# EAGLE design untitled (EAGLE 8.4.3)
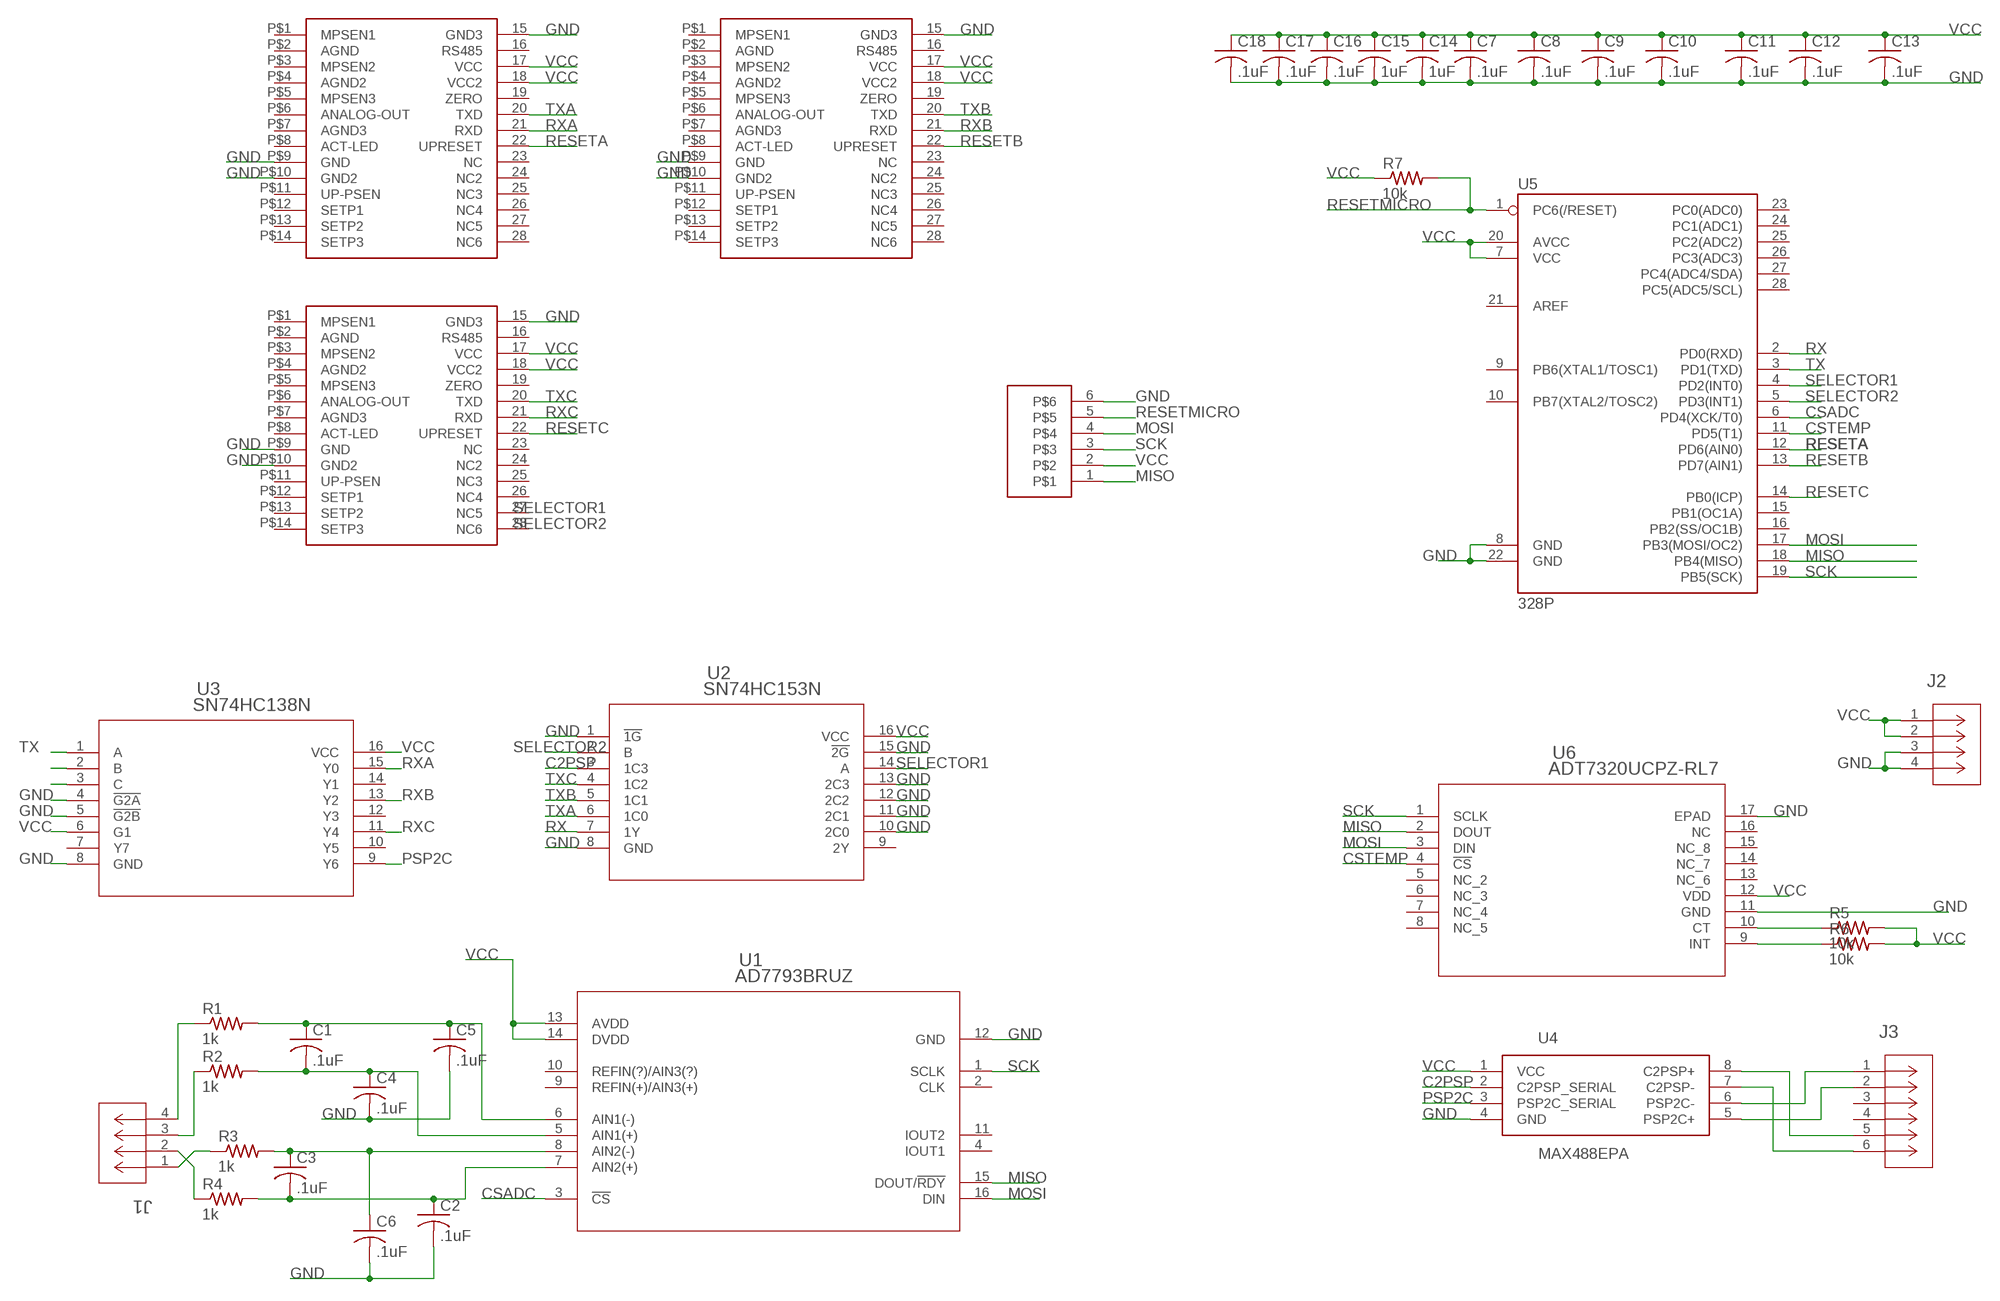
[diagram p0: schematic, sheet 1]

## Parts
C1  .1uF  C-USC0603  [C0603]
C2  .1uF  C-USC0603  [C0603]
C3  .1uF  C-USC0603  [C0603]
C4  .1uF  C-USC0603  [C0603]
C5  .1uF  C-USC0603  [C0603]
C6  .1uF  C-USC0603  [C0603]
C7  .1uF  C-USC0603  [C0603]
C8  .1uF  C-USC0603  [C0603]
C9  .1uF  C-USC0603  [C0603]
C10  .1uF  C-USC0603  [C0603]
C11  .1uF  C-USC0603  [C0603]
C12  .1uF  C-USC0603  [C0603]
C13  .1uF  C-USC0603  [C0603]
C14  1uF  C-USC1206  [C1206]
C15  1uF  C-USC1206  [C1206]
C16  .1uF  C-USC0603  [C0603]
C17  .1uF  C-USC0603  [C0603]
C18  .1uF  C-USC0603  [C0603]
J1  DF11-4  [DF11-4]
J2  DF11-4  [DF11-4]
J3  DF11-6DP-2DSA(01)  [CON6_2X3_UF_DF11]
R1  1k  R-US_R0603  [R0603]
R2  1k  R-US_R0603  [R0603]
R3  1k  R-US_R0603  [R0603]
R4  1k  R-US_R0603  [R0603]
R5  10k  R-US_R0603  [R0603]
R6  10k  R-US_R0603  [R0603]
R7  10k  R-US_R0603  [R0603]
U1  AD7793BRUZ  [RU_16]
U2  SN74HC153N  [N16]
U3  SN74HC138N  [N16]
U4  MAX488EPA  [DIL08]
U5  328P  ATMEGA328P_PDIP  [DIP28]
U6  ADT7320UCPZ-RL7  [CP_16_17]
U$1  PROGRAMMER  [PROGRAMMER]
U$2  MKS-PIRANI  [28PIN]
U$3  MKS-PIRANI  [28PIN]
U$4  MKS-PIRANI  [28PIN]

## Nets
C2PSP: U2.3(1C3) U4.2(C2PSP_SERIAL)
CSADC: U1.3(!CS) U5.6(PD4(XCK/T0))
CSTEMP: U5.11(PD5(T1)) U6.4(!CS)
GND: C2.2 C4.2 C5.2 C6.2 C7.2 C8.2 C9.2 C10.2 C11.2 C12.2 C13.2 C14.2 C15.2 C16.2 C17.2 C18.2 J2.3 J2.4 U1.12(GND) U2.1(!1G) U2.8(GND) U2.10(2C0) U2.11(2C1) U2.12(2C2) U2.13(2C3) U2.15(!2G) U3.4(!G2A) U3.5(!G2B) U3.8(GND) U4.4(GND) U5.8(GND) U5.22(GND) U6.11(GND) U6.17(EPAD) U$1.6 U$2.15(GND3) U$2.P$9(GND) U$2.P$10(GND2) U$3.15(GND3) U$3.P$9(GND) U$3.P$10(GND2) U$4.15(GND3) U$4.P$9(GND) U$4.P$10(GND2)
MISO: U1.15(DOUT/!RDY) U5.18(PB4(MISO)) U6.2(DOUT) U$1.1
MOSI: U1.16(DIN) U5.17(PB3(MOSI/OC2)) U6.3(DIN) U$1.4
N$1: J3.1 U4.6(PSP2C-)
N$2: J3.2 U4.5(PSP2C+)
N$3: J3.5 U4.8(C2PSP+)
N$4: J3.6 U4.7(C2PSP-)
N$5: C3.1 C6.1 R3.2 U1.8(AIN2(-))
N$6: J1.4 R1.1
N$7: J1.3 R2.1
N$8: J1.2 R4.1
N$9: J1.1 R3.1
N$10: C1.2 C4.1 R2.2 U1.5(AIN1(+))
N$13: C1.1 C5.1 R1.2 U1.6(AIN1(-))
N$14: C2.1 C3.2 R4.2 U1.7(AIN2(+))
N$28: R5.1 U6.10(CT)
N$29: R6.1 U6.9(INT)
PSP2C: U3.9(Y6) U4.3(PSP2C_SERIAL)
RESETA: U5.12(PD6(AIN0)) U$2.22(UPRESET)
RESETB: U5.13(PD7(AIN1)) U$4.22(UPRESET)
RESETC: U5.14(PB0(ICP)) U$3.22(UPRESET)
RESETMICRO: R7.2 U5.1(PC6(/RESET)) U$1.5
RX: U2.7(1Y) U5.2(PD0(RXD))
RXA: U3.15(Y0) U$2.21(RXD)
RXB: U3.13(Y2) U$4.21(RXD)
RXC: U3.11(Y4) U$3.21(RXD)
SCK: U1.1(SCLK) U5.19(PB5(SCK)) U6.1(SCLK) U$1.3
SELECTOR1: U2.14(A) U3.2(B) U5.4(PD2(INT0))
SELECTOR2: U2.2(B) U3.3(C) U5.5(PD3(INT1))
TX: U3.1(A) U5.3(PD1(TXD))
TXA: U2.6(1C0) U$2.20(TXD)
TXB: U2.5(1C1) U$4.20(TXD)
TXC: U2.4(1C2) U$3.20(TXD)
VCC: C7.1 C8.1 C9.1 C10.1 C11.1 C12.1 C13.1 C14.1 C15.1 C16.1 C17.1 C18.1 J2.1 J2.2 R5.2 R6.2 R7.1 U1.13(AVDD) U1.14(DVDD) U2.16(VCC) U3.6(G1) U3.16(VCC) U4.1(VCC) U5.7(VCC) U5.20(AVCC) U6.12(VDD) U$1.2 U$2.17(VCC) U$2.18(VCC2) U$3.17(VCC) U$3.18(VCC2) U$4.17(VCC) U$4.18(VCC2)
Unconnected: J3.3 J3.4 U1.2(CLK) U1.4(IOUT1) U1.9(REFIN(+)/AIN3(+)) U1.10(REFIN(?)/AIN3(?)) U1.11(IOUT2) U2.9(2Y) U3.7(Y7) U3.10(Y5) U3.12(Y3) U3.14(Y1) U5.9(PB6(XTAL1/TOSC1)) U5.10(PB7(XTAL2/TOSC2)) U5.15(PB1(OC1A)) U5.16(PB2(SS/OC1B)) U5.21(AREF) U5.23(PC0(ADC0)) U5.24(PC1(ADC1)) U5.25(PC2(ADC2)) U5.26(PC3(ADC3)) U5.27(PC4(ADC4/SDA)) U5.28(PC5(ADC5/SCL)) U6.5(NC_2) U6.6(NC_3) U6.7(NC_4) U6.8(NC_5) U6.13(NC_6) U6.14(NC_7) U6.15(NC_8) U6.16(NC) U$2.16(RS485) U$2.19(ZERO) U$2.23(NC) U$2.24(NC2) U$2.25(NC3) U$2.26(NC4) U$2.27(NC5) U$2.28(NC6) U$2.P$1(MPSEN1) U$2.P$2(AGND) U$2.P$3(MPSEN2) U$2.P$4(AGND2) U$2.P$5(MPSEN3) U$2.P$6(ANALOG-OUT) U$2.P$7(AGND3) U$2.P$8(ACT-LED) U$2.P$11(UP-PSEN) U$2.P$12(SETP1) U$2.P$13(SETP2) U$2.P$14(SETP3) U$3.16(RS485) U$3.19(ZERO) U$3.23(NC) U$3.24(NC2) U$3.25(NC3) U$3.26(NC4) U$3.27(NC5) U$3.28(NC6) U$3.P$1(MPSEN1) U$3.P$2(AGND) U$3.P$3(MPSEN2) U$3.P$4(AGND2) U$3.P$5(MPSEN3) U$3.P$6(ANALOG-OUT) U$3.P$7(AGND3) U$3.P$8(ACT-LED) U$3.P$11(UP-PSEN) U$3.P$12(SETP1) U$3.P$13(SETP2) U$3.P$14(SETP3) U$4.16(RS485) U$4.19(ZERO) U$4.23(NC) U$4.24(NC2) U$4.25(NC3) U$4.26(NC4) U$4.27(NC5) U$4.28(NC6) U$4.P$1(MPSEN1) U$4.P$2(AGND) U$4.P$3(MPSEN2) U$4.P$4(AGND2) U$4.P$5(MPSEN3) U$4.P$6(ANALOG-OUT) U$4.P$7(AGND3) U$4.P$8(ACT-LED) U$4.P$11(UP-PSEN) U$4.P$12(SETP1) U$4.P$13(SETP2) U$4.P$14(SETP3)

## Library data of the parts
C1-C18 = customrescap:C-US: CAPACITOR, American symbol
J1 J2 = libraryv4:DF11-4
J3 = libraryv4:DF11-6DP-2DSA(01)
R1-R7 = customrescap:R-US_: RESISTOR, American symbol
U1 = libraryv4:AD7793BRUZ; MANUFACTURER_PART_NUMBER: AD7793BRUZ; VENDOR: Analog Devices Inc
U2 = libraryv4:SN74HC153N; MANUFACTURER_PART_NUMBER: SN74HC153N; VENDOR: Texas Instruments
U3 = libraryv4:SN74HC138N; MANUFACTURER_PART_NUMBER: SN74HC138N; VENDOR: Texas Instruments
U4 = libraryv4:MAX488EPA
U5 = libraryv4:ATMEGA328P_PDIP: Atmel 328P Through hole ATMEGA328P uC used in the Arduino 32kb flash, 1k EEPROM, 2k SRAM Datasheet <http://www.sparkfun.com/datasheets/Components/SMD/ATMega328.pdf> SparkFun Products Storefront component: AVR 28 Pin 20MHz 32K 6A/D - ATMega328P <https://www.sparkfun.com/products/9061> (COM-09061) SparkFun Simon Says - Through-Hole Soldering Kit <https://www.sparkfun.com/products/10547> (KIT-10547) SparkFun Learn to Solder - Simon Says <https://www.sparkfun.com/products/13708> (KIT-13708) SparkFun BigTime Watch Kit <https://www.sparkfun.com/products/11734> (KIT-11734) SparkFun ClockIt <https://www.sparkfun.com/products/10930> (KIT-10930) SparkFun Serial Enabled LCD Kit <https://www.sparkfun.com/products/10097> (LCD-10097) SparkFun Simon Tilts - Through Hole Soldering Kit <https://www.sparkfun.com/products/12634> (KIT-12634) SparkFun Frequency Counter Kit <https://www.sparkfun.com/products/10140> (KIT-10140) FabFM Radio Kit <https://www.sparkfun.com/products/11043> (KIT-11043) SparkFun Binary Blaster Kit <https://www.sparkfun.com/products/12037> (KIT-12037) SparkFun Metro-Gnome <https://www.sparkfun.com/products/9236> (KIT-09236) ATmega328 with Arduino Optiboot (Uno) <https://www.sparkfun.com/products/10524> (DEV-10524); PROD_ID: IC-09136
U6 = libraryv4:ADT7320UCPZ-RL7; MANUFACTURER_PART_NUMBER: ADT7320UCPZRL7; VENDOR: Analog Devices Inc
U$1 = libraryv4:PROGRAMMER
U$2-U$4 = libraryv4:MKS-PIRANI

## Board
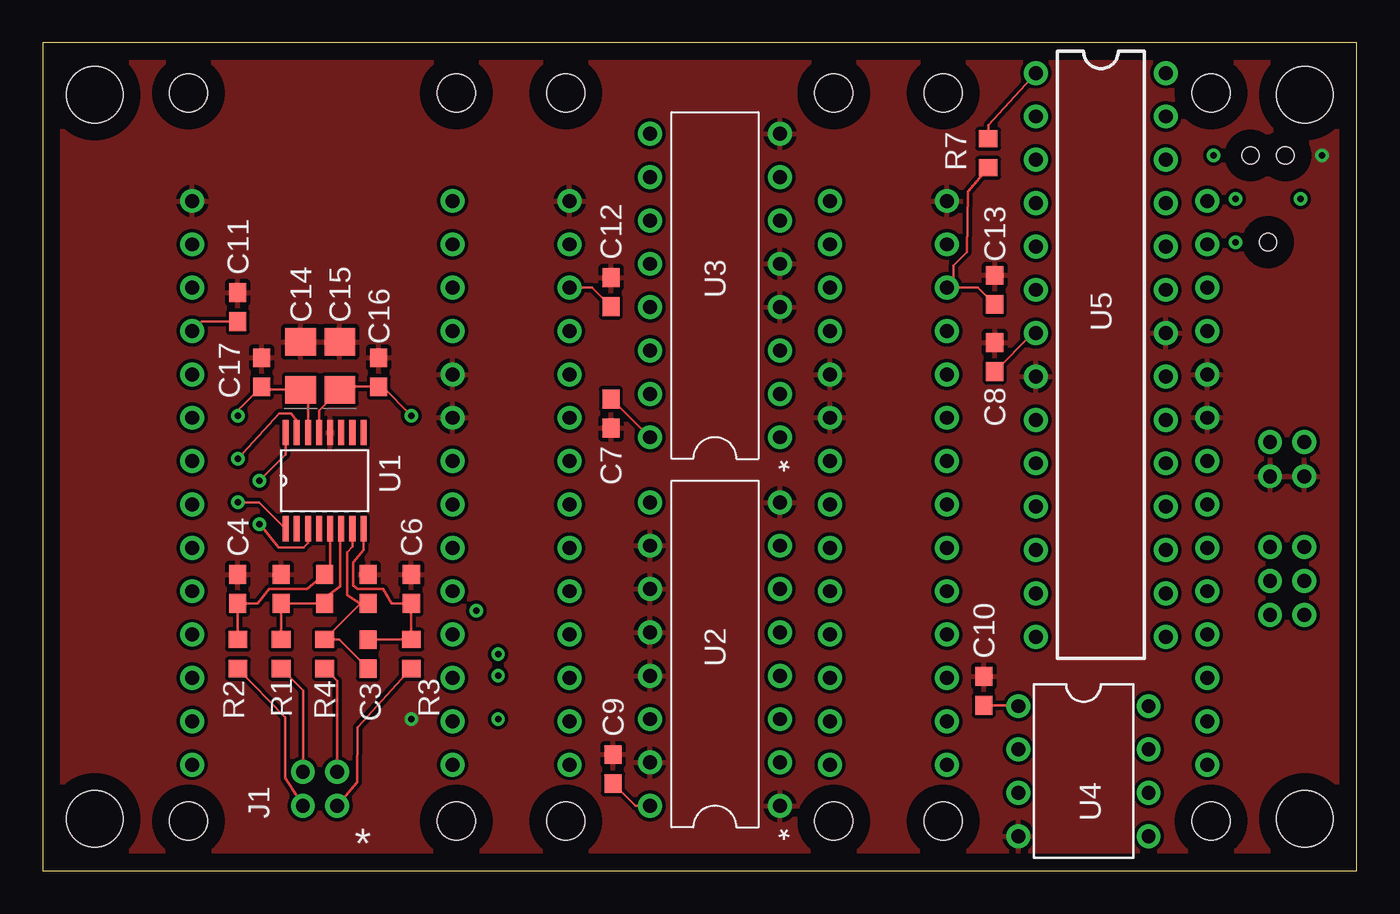
[diagram p1: board, top side]
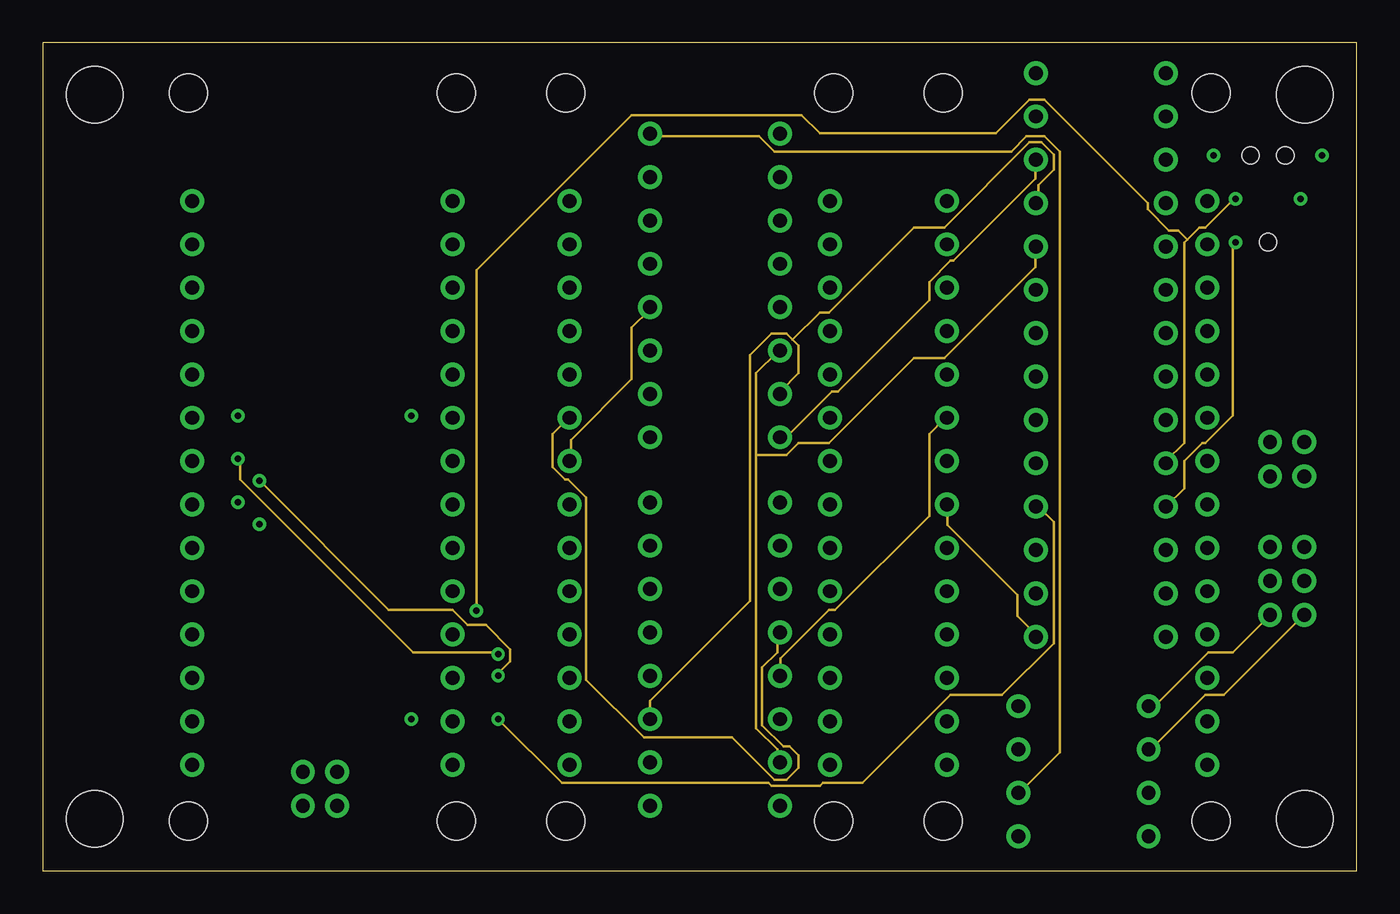
[diagram p2: board, inner layer Route2]
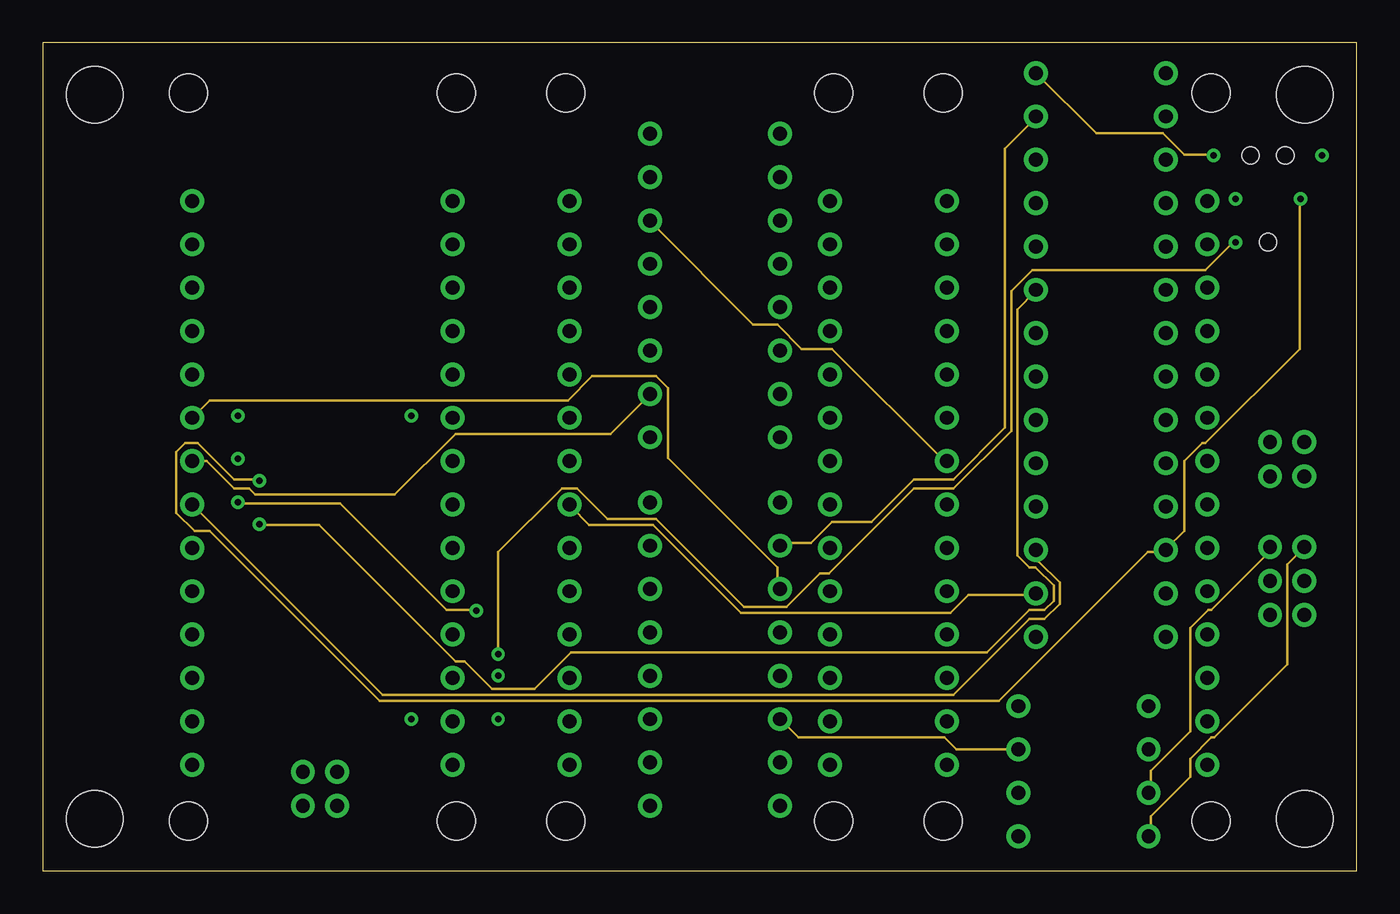
[diagram p3: board, inner layer Route3]
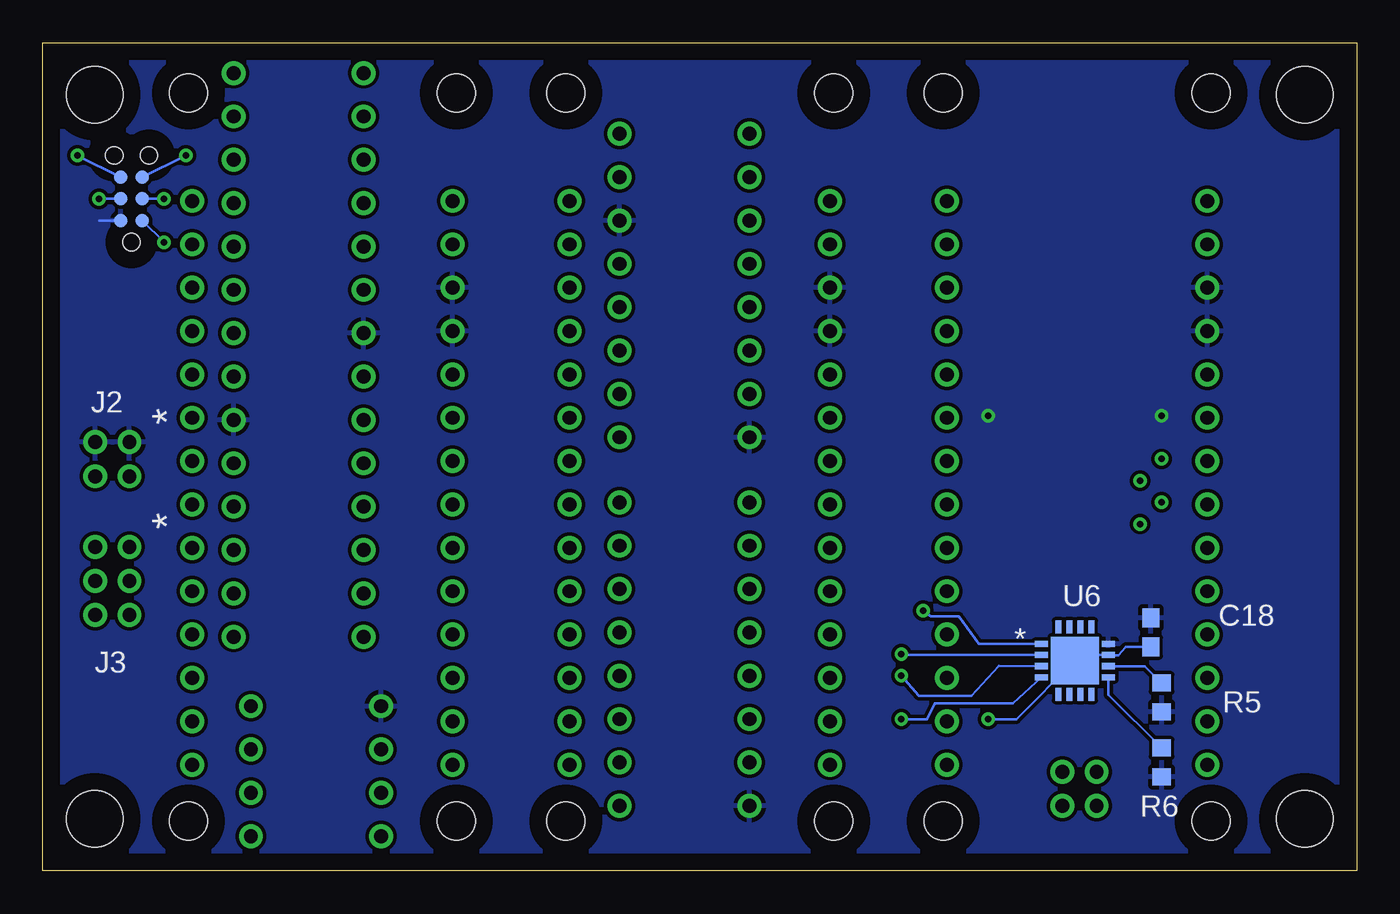
[diagram p4: board, bottom side, seen from below]

Size 76.96 x 48.51 mm. Coordinates in mm from the lower left corner, seen from the top.
Outline: 0,0 76.96,0 76.96,48.51 0,48.51 0,0
Copper layers (1*2*3*16): Top 0.035mm / dielectric 1.5mm / Route2 0.035mm / dielectric 0.15mm / Route3 0.035mm / dielectric 0.2mm / Bottom 0.035mm
Design rules "default *": minimum track width 6mil, minimum drill 15mil, track to track 8mil, track to pad 8mil, pad to pad 8mil, via to via 8mil, smd to smd 6mil, copper to edge 40mil, drill to drill 6mil, minimum pad ring 10mil, minimum via ring 8mil, stop-mask expansion 4mil, vias tented up to drill 0mil, thermal gap 10mil
Holes 3.3 mm at 3.05,3.05 3.05,45.47 73.91,45.47 73.91,3.05

### Footprints (pad centres in the part's own frame; a part is rotated, then mirrored left to right if it is on the bottom)
C0603 = smd 1.1 x 1: 1 -0.85,0; 2 0.85,0
C1206 = smd 1.6 x 1.8: 1 -1.4,0; 2 1.4,0
DF11-4 = drill 0.813 pad 1.397: 1 2,0; 2 2,2; 3 0,0; 4 0,2
CON6_2X3_UF_DF11 = drill 0.813 pad 1.397: 1 4,0; 2 4,2; 3 2,0; 4 2,2; 5 0,0; 6 0,2
R0603 = smd 1 x 1.1: 1 -0.85,0; 2 0.85,0
RU_16 = smd 1.473 x 0.356: 1 -2.819,2.275; 2 -2.819,1.625; 3 -2.819,0.975; 4 -2.819,0.325; 5 -2.819,-0.325; 6 -2.819,-0.975; 7 -2.819,-1.625; 8 -2.819,-2.275; 9 2.819,-2.275; 10 2.819,-1.625; 11 2.819,-0.975; 12 2.819,-0.325; 13 2.819,0.325; 14 2.819,0.975; 15 2.819,1.625; 16 2.819,2.275
N16 = drill 0.813 pad 1.397: 1 -7.62,17.78; 2 -7.62,15.24; 3 -7.62,12.7; 4 -7.62,10.16; 5 -7.62,7.62; 6 -7.62,5.08; 7 -7.62,2.54; 8 -7.62,0; 9 0,0; 10 0,2.54; 11 0,5.08; 12 0,7.62; 13 0,10.16; 14 0,12.7; 15 0,15.24; 16 0,17.78
DIL08 = drill 0.813 pad 1.397: 1 -3.81,-3.81; 2 -1.27,-3.81; 3 1.27,-3.81; 4 3.81,-3.81; 5 3.81,3.81; 6 1.27,3.81; 7 -1.27,3.81; 8 -3.81,3.81
DIP28 = drill 0.813 pad 1.397: 1 -16.51,-3.81; 2 -13.97,-3.81; 3 -11.43,-3.81; 4 -8.89,-3.81; 5 -6.35,-3.81; 6 -3.81,-3.81; 7 -1.27,-3.81; 8 1.27,-3.81; 9 3.81,-3.81; 10 6.35,-3.81; 11 8.89,-3.81; 12 11.43,-3.81; 13 13.97,-3.81; 14 16.51,-3.81; 15 16.51,3.81; 16 13.97,3.81; 17 11.43,3.81; 18 8.89,3.81; 19 6.35,3.81; 20 3.81,3.81; 21 1.27,3.81; 22 -1.27,3.81; 23 -3.81,3.81; 24 -6.35,3.81; 25 -8.89,3.81; 26 -11.43,3.81; 27 -13.97,3.81; 28 -16.51,3.81
CP_16_17 = smd 0.762 x 0.356: 1 -1.968,0.975; 2 -1.968,0.325; 3 -1.968,-0.325; 4 -1.968,-0.975; 9 1.968,-0.975; 10 1.968,-0.325; 11 1.968,0.325; 12 1.968,0.975 | smd 0.356 x 0.762: 5 -0.975,-1.968; 6 -0.325,-1.968; 7 0.325,-1.968; 8 0.975,-1.968; 13 0.975,1.968; 14 0.325,1.968; 15 -0.325,1.968; 16 -0.975,1.968 | smd 2.794 x 2.794: 17 0,0
PROGRAMMER = smd 0.787 x 0.787: 1 1.27,0; 2 1.27,1.27; 3 2.54,0; 4 2.54,1.27; 5 3.81,0; 6 3.81,1.27 | hole 0.991: 0,0.635; 5.08,-0.381; 5.08,1.651
28PIN = drill 0.813 pad 1.397: 15 2.794,38.862; 16 2.794,36.322; 17 2.794,33.782; 18 2.794,31.242; 19 2.794,28.702; 20 2.794,26.162; 21 2.794,23.622; 22 2.794,21.082; 23 2.794,18.542; 24 2.794,16.002; 25 2.794,13.462; 26 2.794,10.922; 27 2.794,8.382; 28 2.794,5.842; P$1 18.034,5.842; P$2 18.034,8.382; P$3 18.034,10.922; P$4 18.034,13.462; P$5 18.034,16.002; P$6 18.034,18.542; P$7 18.034,21.082; P$8 18.034,23.622; P$9 18.034,26.162; P$10 18.034,28.702; P$11 18.034,31.242; P$12 18.034,33.782; P$13 18.034,36.322; P$14 18.034,38.862 | hole 2.21: 18.263,45.187; 2.565,45.187; 18.263,2.54; 2.565,2.54

### Placement (x,y rotation side)
C1  16.51,16.51 90 top
C2  19.05,16.51 90 top
C3  19.05,12.7 270 top
C4  11.43,16.51 90 top
C5  13.97,16.51 90 top
C6  21.59,16.51 90 top
C7  33.27,26.8 270 top
C8  55.75,30.1 90 top
C9  33.4,5.97 90 top
C10  55.12,10.54 90 top
C11  11.43,33.02 90 top
C12  33.27,33.91 90 top
C13  55.75,34.04 90 top
C14  15.11,29.59 90 top
C15  17.4,29.59 90 top
C16  19.68,29.21 90 top
C17  12.83,29.21 90 top
C18  12.06,13.97 270 bottom
J1  15.24,3.81 0 top
J2  71.88,23.11 90 bottom
J3  71.88,14.99 90 bottom
R1  13.97,12.7 90 top
R2  11.43,12.7 90 top
R3  21.59,12.7 90 top
R4  16.51,12.7 90 top
R5  11.43,10.16 270 bottom
R6  11.43,6.35 270 bottom
R7  55.37,42.04 90 top
U1  16.51,22.86 90 top
U2  35.56,21.59 180 top
U3  35.56,43.18 180 top
U4  60.96,5.84 270 top
U5  61.98,30.23 270 top
U6  16.51,12.32 0 bottom
U$1  71.12,36.83 90 bottom
U$2  5.97,0.38 0 top
U$3  50.16,0.38 0 top
U$4  28.07,0.38 0 top

### Tracks (layer width: path | path; a pad name or v marks a point on that pad's centre or on a via)
C2PSP
  Route3 0.152: U4.2 53.52,7.11 52.81,7.82 44.27,7.82 43.2,8.89 U2.3
CSADC  (via drill 0.38)
  Top 0.152: U1.3 15.54,19.8 15.54,19.21 15.28,18.95 13.82,18.95 v12.7,20.32
  Route3 0.152: v12.7,20.32 12.8,20.27 16.18,20.27 24.18,12.27 24.71,12.27 26.31,10.67 28.8,10.67 30.94,12.8 55.3,12.8 57.78,15.29 58.67,15.29 59.21,15.82 59.21,16.71 58.14,17.78 57.78,17.78 57.07,18.49 57.07,32.89 58.14,33.96 U5.6
CSTEMP  (via drill 0.38)
  Route2 0.152: v26.67,8.89 30.4,5.16 42.49,5.16 42.67,4.98 45.52,4.98 45.7,5.16 48.01,5.16 53.16,10.31 56.19,10.31 59.21,13.34 59.21,20.45 58.32,21.34 U5.11
  Bottom 0.152: v26.67,8.89 25.19,8.89 24.72,9.82 20.13,9.82 U6.4
GND  (via drill 0.38)
  Bottom 0.152: C18.2 13.53,13.12 13.96,12.63 14.3,12.63 U6.11 16.18,12.64 U6.17 19.94,8.89 v21.59,8.89 | U$1.6 v74.93,41.91
  pour Top: 0,48.51 76.96,48.51 76.96,0 0,0
MISO  (via drill 0.38)
  Top 0.152: U1.15 14.88,26.39 14.55,26.8 13.84,26.8 v11.43,24.13
  Route2 0.152: U5.18 66.85,22.4 66.85,24 67.92,25.07 68.1,25.07 69.7,26.67 69.7,36.8 v69.85,36.83 | v11.43,24.13 11.56,24 11.56,22.94 21.69,12.8 26.67,12.8 v26.67,12.7
  Route3 0.152: v26.67,12.7 26.67,18.67 30.4,22.4 31.29,22.4 33.07,20.62 35.92,20.62 41.07,15.47 43.56,15.47 45.52,17.42 46.05,17.42 51.03,22.4 53.34,22.4 56.72,25.78 56.72,33.96 57.96,35.2 68.1,35.2 69.7,36.8 v69.85,36.83
  Bottom 0.152: U6.2 26.61,12.64 v26.67,12.7 | U$1.1 v69.85,36.83
MOSI  (via drill 0.38)
  Top 0.152: U1.16 14.23,24.39 v12.7,22.86
  Route2 0.152: v12.7,22.86 20.27,15.29 24,15.29 24.89,14.4 25.96,14.4 27.38,12.98 27.38,12.27 26.67,11.56 v26.67,11.43
  Route3 0.152: v73.66,39.37 73.61,39.29 73.61,30.58 68.1,25.07 67.92,25.07 66.85,24 66.85,19.91 65.79,18.85 U5.17 65.79,18.67 64.72,18.67 56.01,9.96 19.74,9.96 9.78,19.91 8.89,19.91 7.82,20.98 7.82,24.54 8.36,25.07 9.07,25.07 11.2,22.94 12.62,22.94 v12.7,22.86
  Bottom 0.152: U6.3 20.97,12.02 22.58,10.25 25.64,10.25 v26.67,11.43 | U$1.4 v73.66,39.37
N$1
  Route3 0.152: U4.6 64.9,4.62 64.9,5.87 67.21,8.18 67.21,14.22 68.28,15.29 68.45,15.29 72.01,18.85 J3.1
N$2
  Route3 0.152: U4.5 64.9,2.13 64.9,3.2 67.21,5.51 67.21,6.58 68.45,7.82 68.63,7.82 72.9,12.09 72.9,17.96 73.79,18.85 J3.2
N$3
  Route2 0.152: J3.5 69.7,12.8 68.28,12.8 65.25,9.78 64.9,9.78 U4.8
N$4
  Route2 0.152: U4.7 64.9,7.11 68.1,10.31 69.16,10.31 73.79,14.94 J3.6
N$5
  Top 0.152: C3.1 R3.2 C6.1 20.42,15.66 19.95,16.52 19.6,16.52 19.05,16.51 18.45,16.51 18.19,16.71 18.19,18.08 18.79,18.8 U1.8
N$6
  Top 0.152: J1.4 15.24,10.58 R1.1
N$7
  Top 0.152: J1.3 14.19,5.45 14.19,8.99 R2.1
N$8
  Top 0.152: R4.1 17.24,11.12 J1.2
N$9
  Top 0.152: J1.1 18.42,5.2 18.45,8.4 R3.1
N$10
  Top 0.152: R2.2 C4.1 12.6,15.66 13.27,16.52 15.49,16.52 C1.2 arc90 16.84,17.68 U1.5
N$13
  Top 0.152: R1.2 C5.1 C1.1 16.51,15.99 17.42,16.67 17.42,19.92 U1.6
N$14
  Top 0.152: C3.2 17.35,13.55 R4.2 18.62,15.66 C2.1 18.66,15.62 17.82,16.18 17.84,18.65 18.14,19.01 U1.7
N$28
  Bottom 0.152: R5.1 12.41,11.99 U6.10
N$29
  Bottom 0.152: R6.1 14.54,10.31 U6.9
PSP2C
  Route2 0.152: U3.9 35.56,43.03 41.96,43.03 42.85,42.14 56.72,42.14 57.61,43.03 58.67,43.03 59.56,42.14 59.56,6.93 57.25,4.62 U4.3
RESETA
  Route3 0.152: U$2.22 19.91,10.31 53.34,10.31 57.78,14.76 58.67,14.76 59.56,15.65 59.56,16.89 58.32,18.14 58.32,18.67 U5.12
RESETB
  Route3 0.152: U5.13 58.14,16.18 54.23,16.18 53.16,15.11 40.89,15.11 35.74,20.27 32,20.27 30.94,21.34 U$4.22
RESETC
  Route2 0.152: U$3.22 52.98,21.34 52.98,20.27 57.07,16.18 57.07,14.94 58.14,13.87 U5.14
RESETMICRO  (via drill 0.38)
  Top 0.152: R7.2 55.37,43.69 U5.1
  Route3 0.152: U5.1 61.7,43.2 65.61,43.2 66.85,41.96 68.45,41.96 v68.58,41.91
  Bottom 0.152: U$1.5 v68.58,41.91
RX
  Route3 0.152: U2.7 43.2,19.2 44.98,19.2 46.23,20.45 48.54,20.45 51.03,22.94 53.34,22.94 56.36,25.96 56.36,42.32 58.14,44.09 U5.2
RXA
  Route3 0.152: U$2.21 9.6,24 11.2,22.4 12.09,22.4 12.45,22.05 20.62,22.05 24.18,25.6 33.25,25.6 35.56,27.91 U3.15
RXB
  Route2 0.152: U$4.21 30.94,24 30.94,25.25 34.49,28.8 34.49,31.83 35.56,32.89 U3.13
RXC
  Route3 0.152: U$3.21 52.81,24 46.23,30.58 44.45,30.58 43.03,32 41.6,32 35.56,38.05 U3.11
SCK  (via drill 0.38)
  Top 0.152: U1.1 12.69,21.59 v11.43,21.59
  Route2 0.152: 67.03,36.98 66.85,36.8 66.85,25.07 65.79,24 U5.19 | 67.03,36.98 67.74,37.69 68.1,37.69 69.7,39.29 v69.85,39.37 | 67.03,36.98 66.5,37.52 65.96,37.52 64.72,38.76 64.72,39.12 58.67,45.16 57.78,45.16 55.83,43.2 45.52,43.2 44.45,44.27 34.49,44.27 25.43,35.2 25.43,15.29 v25.4,15.24
  Route3 0.152: v11.43,21.59 11.56,21.51 17.42,21.51 23.65,15.29 25.25,15.29 v25.4,15.24
  Bottom 0.152: U6.1 22.14,13.29 23.31,14.9 24.96,14.9 v25.4,15.24 | U$1.3 v69.85,39.37
SELECTOR1
  Route2 0.152: U2.14 35.56,9.96 41.43,15.82 41.43,30.23 42.67,31.47 43.56,31.47 43.92,31.11 | 43.92,31.11 44.27,30.76 44.27,29.16 43.2,28.09 U3.2 | 43.92,31.11 45.52,32.72 46.05,32.72 51.03,37.69 52.81,37.69 57.78,42.67 58.5,42.67 59.21,41.96 59.21,41.07 58.32,40.18 58.32,39.12 U5.4
SELECTOR2
  Route2 0.152: 41.78,24.36 41.78,29.16 43.03,30.4 U3.3 | 41.78,24.36 41.78,8.36 43.03,7.11 43.03,6.4 U2.2 | 41.78,24.36 43.56,24.36 44.27,25.07 46.05,25.07 51.03,30.05 52.81,30.05 58.14,35.38 58.14,36.45 U5.5
TX
  Route2 0.152: U3.1 43.2,25.43 43.56,25.43 46.23,28.09 46.58,28.09 51.92,33.43 51.92,34.49 53.16,35.74 53.34,35.74 58.14,40.54 58.14,41.6 U5.3
TXA
  Route3 0.152: U$2.20 9.78,27.56 30.76,27.56 32.18,28.98 35.92,28.98 36.63,28.27 36.63,24.18 43.03,17.78 43.03,16.54 U2.6
TXB
  Route2 0.152: U2.5 43.03,13.87 43.03,12.8 42.14,11.91 42.14,8.53 43.38,7.29 43.74,7.29 44.27,6.76 44.27,6.04 43.56,5.33 42.85,5.33 40.36,7.82 35.2,7.82 31.83,11.2 31.83,21.87 30.76,22.94 30.58,22.94 29.87,23.65 29.87,25.6 30.76,26.49 U$4.20
TXC
  Route2 0.152: U2.4 43.2,11.56 43.2,12.45 46.05,15.29 46.41,15.29 51.92,20.8 51.92,25.6 52.81,26.49 U$3.20
VCC  (via drill 0.38)
  Top 0.152: U1.14 15.54,27.77 arc90 C14.1 13,28.19 C17.1 11.43,26.96 v11.43,26.67 | U1.13 16.18,26.98 C15.1 17.57,28.36 C16.1 19.9,28.36 v21.59,26.67 | U$2.18 9.31,32.17 C11.1 | C12.1 32.17,34.16 U$4.17 | C7.1 33.57,27.94 arc90 C7.1 | C9.1 34.71,3.81 U2.16 | C10.1 57.11,9.69 U4.1 | 53.34,34.16 U$3.17 | 53.34,34.16 54.78,34.16 C13.1 | C8.1 58,31.5 U5.7 | R7.1 54.19,39.78 54.12,36.24 53.34,35.47 53.34,34.16 | U3.16 33.31,27.65 C7.1
  Bottom 0.152: U$1.2 73.66,38.1
  pour Bottom: 0,48.51 76.96,48.51 76.96,0 0,0